# Altium schematic sheet SelfDrivingCar_SCH_Others.SchDoc
size A; DocumentNumber: 7; SheetNumber: 6; SheetTotal: 7
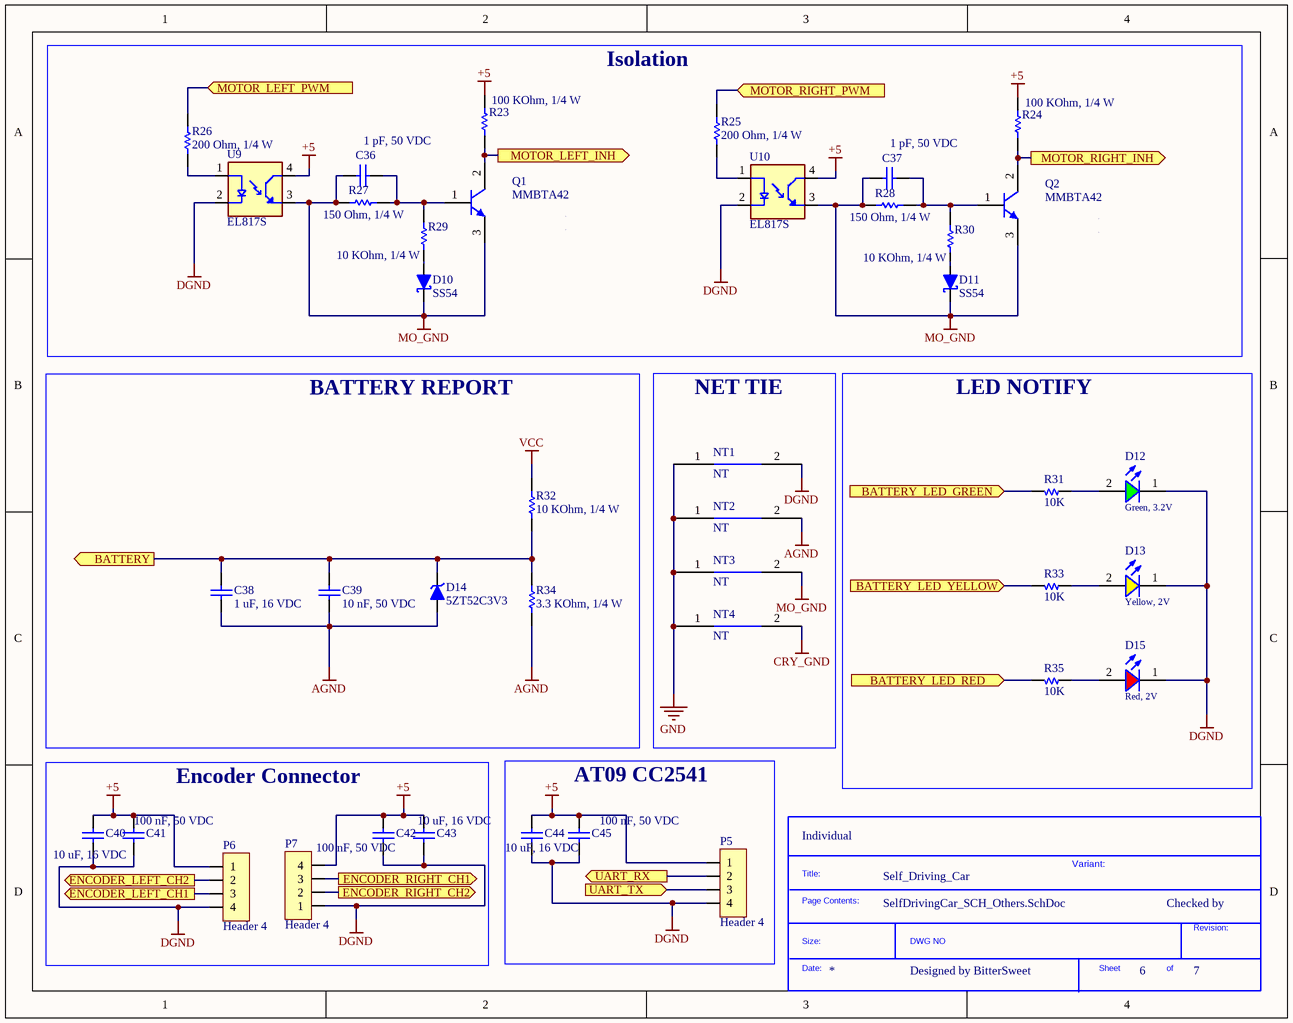
[diagram p0: SelfDrivingCar_SCH_Others.SchDoc]

## Parts
*?  SDTitleBlock  (value not drawn)  (graphical)
C36  1 pF, 50 VDC  [CAP_0603]
C37  1 pF, 50 VDC  [CAP_0603]
C38  1 uF, 16 VDC  [CAP_0603]
C39  10 nF, 50 VDC  [CAP_0603]
C40  10 uF, 16 VDC  [CAP_0603]
C41  100 nF, 50 VDC  [CAP_0603]
C42  100 nF, 50 VDC  [CAP_0603]
C43  10 uF, 16 VDC  [CAP_0603]
C44  10 uF, 16 VDC  [CAP_0603]
C45  100 nF, 50 VDC  [CAP_0603]
D10  SS54  [DO-214AC (SMA)]
D11  SS54  [DO-214AC (SMA)]
D12  Green, 3.2V  [WL-SMCW_0603_H=0.7mm]
D13  Yellow, 2V  [WL-SMCW_0603_H=0.7mm]
D14  5ZT52C3V3  [SOD123]
D15  Red, 2V  [WL-SMCW_0603_H=0.7mm]
NT1  NT  [NETTIE_2_0mm]  (net tie, no BOM)
NT2  NT  [NETTIE_0_5mm]  (net tie, no BOM)
NT3  NT  [NETTIE_2_0mm]  (net tie, no BOM)
NT4  NT  [NETTIE_0_5mm]  (net tie, no BOM)
P5  Header 4  [HDR/Header/4/BOX/SMD]
P6  Header 4  [HDR/Header/4/BOX/SMD]
P7  Header 4  [HDR/Header/4/BOX/SMD]
Q1  MMBTA42  [MMBT-SOT23]
Q2  MMBTA42  [MMBT-SOT23]
R23  100 KOhm, 1/4 W  [resistor_0603]
R24  100 KOhm, 1/4 W  [resistor_0603]
R25  200 Ohm, 1/4 W  [resistor_0603]
R26  200 Ohm, 1/4 W  [resistor_0603]
R27  150 Ohm, 1/4 W  [resistor_0603]
R28  150 Ohm, 1/4 W  [resistor_0603]
R29  10 KOhm, 1/4 W  [resistor_0603]
R30  10 KOhm, 1/4 W  [resistor_0603]
R31  10K  [R 0603]
R32  10 KOhm, 1/4 W  [resistor_0603]
R33  10K  [R 0603]
R34  3.3 KOhm, 1/4 W  [resistor_0603]
R35  10K  [R 0603]
U9  EL817S  [EL817S]
U10  EL817S  [EL817S]

## Blocks framed on the sheet
Isolation: C36 C37 D10 D11 Q1 Q2 R23-R30 U9 U10
BATTERY REPORT: C38 C39 D14 R32 R34
NET TIE: NT1-NT4
LED NOTIFY: D12 D13 D15 R31 R33 R35
Encoder Connector: C40-C43 P6 P7
AT09 CC2541: C44 C45 P5

## Ports
BATTERY (out), BATTERY_LED_GREEN (in), BATTERY_LED_RED (in), BATTERY_LED_YELLOW (in), ENCODER_LEFT_CH1 (out), ENCODER_LEFT_CH2 (out), ENCODER_RIGHT_CH1 (out), ENCODER_RIGHT_CH2 (out), MOTOR_LEFT_INH (out), MOTOR_LEFT_PWM (in), MOTOR_RIGHT_INH (out), MOTOR_RIGHT_PWM (in), UART_RX (out), UART_TX (in)

## Nets
+5: C40.2 C41.2 C42.2 C43.2 C44.2 C45.2 P5.1 P6.1 P7.4 R23.2 R24.2 U9.4(CT) U10.4(CT)
AGND: C38.2 C39.1 D14.1(A) NT2.2 R34.1
CRY_GND: NT4.2
DGND: C40.1 C41.1 C42.1 C43.1 C44.1 C45.1 D12.1(K) D13.1(K) D15.1(K) NT1.2 P5.4 P6.4 P7.1 U9.2(C) U10.2(C)
GND: NT1.1 NT2.1 NT3.1 NT4.1
MO_GND: C36.2 C37.2 D10.2(K) D11.2(K) NT3.2 Q1.3(E) Q2.3(E) R27.1 R28.1 U9.3(ET) U10.3(ET)
VCC: R32.2
BATTERY: C38.1 C39.2 D14.2(K) R32.1 R34.2 ; port BATTERY
BATTERY_LED_GREEN: R31.2 ; port BATTERY_LED_GREEN
BATTERY_LED_RED: R35.2 ; port BATTERY_LED_RED
BATTERY_LED_YELLOW: R33.2 ; port BATTERY_LED_YELLOW
ENCODER_LEFT_CH1: P6.3 ; port ENCODER_LEFT_CH1
ENCODER_LEFT_CH2: P6.2 ; port ENCODER_LEFT_CH2
ENCODER_RIGHT_CH1: P7.3 ; port ENCODER_RIGHT_CH1
ENCODER_RIGHT_CH2: P7.2 ; port ENCODER_RIGHT_CH2
MOTOR_LEFT_INH: Q1.2(C) R23.1 ; port MOTOR_LEFT_INH
MOTOR_LEFT_PWM: R26.2 ; port MOTOR_LEFT_PWM
MOTOR_RIGHT_INH: Q2.2(C) R24.1 ; port MOTOR_RIGHT_INH
MOTOR_RIGHT_PWM: R25.2 ; port MOTOR_RIGHT_PWM
UART_RX: P5.2 ; port UART_RX
UART_TX: P5.3 ; port UART_TX
NetC36_1: C36.1 Q1.1(B) R27.2 R29.2
NetC37_1: C37.1 Q2.1(B) R28.2 R30.2
NetD10_1: D10.1(A) R29.1
NetD11_1: D11.1(A) R30.1
NetD12_2: D12.2(A) R31.1
NetD13_2: D13.2(A) R33.1
NetD15_2: D15.2(A) R35.1
NetR25_1: R25.1 U10.1(A)
NetR26_1: R26.1 U9.1(A)

## Notes on the sheet
- (near *?) Individual
- Self_Driving_Car
- Variant:
- Checked by
- Designed by BitterSweet
- (in symbol SDTitleBlock) Title:; Page Contents:; Revision:; Size:; DWG NO; Date:; Sheet; of

## Library data of the parts
C36 C37 = 0106031051016: CAP, size 0603, 1 pF, 50 VDC; Manufacture Name: Samsung Electro-Mechanics; Manufacture SN: CL10B105KO8NNWC; Capacitance: 1 uF; Tolerance: +/-10%; Voltage Rating DC: 50 VDC; ComponentLink2Description: Datasheet; ComponentLink2URL: https://www.mouser.vn/datasheet/2/585/Samsung_MLCC_1837944-1929650.pdf; Operating Temperature: -55 to +125degC; Packaging: Tape and Reel; Mounting Technology: SMT; Size: 0603; Supplier 1 Name: Mouser; Supplier 1 SN: 187-CL10B105KO8NNWC; Supplier 1 URL: https://www.mouser.vn/ProductDetail/Samsung-Electro-Mechanics/CL10B105KO8NNWC?qs=81r%252BiQLm7BT%252BXtc72qn1ug%3D%3D&utm_source=mouser-refine-download&utm_medium=file&utm_campaign=CL10B105KO8NNWC&utm_content=Samsung-Electro-Mechanics; Supplier 2 Name: Digi-Key; Supplier 2 SN: 1276-CL10B105KO8NNWCTR-ND; Supplier 2 URL: https://www.digikey.com/en/products/detail/samsung-electro-mechanics/cl10b105ko8nnwc/16572783; Supplier 3 Name: thegioiic; Supplier 3 SN: N/A; Supplier 3 URL: https://www.thegioiic.com/tu-gom-0603-1uf-16v; Value: 1 pF, 50 VDC
C38 = 0106031051016: CAP, size 0603, 1 uF, 16 VDC; Manufacture Name: Samsung Electro-Mechanics; Manufacture SN: CL10B105KO8NNWC; Capacitance: 1 uF; Tolerance: +/-10%; Voltage Rating DC: 16 VDC; ComponentLink2Description: Datasheet; ComponentLink2URL: https://www.mouser.vn/datasheet/2/585/Samsung_MLCC_1837944-1929650.pdf; Operating Temperature: -55 to +125degC; Packaging: Tape and Reel; Mounting Technology: SMT; Size: 0603; Supplier 1 Name: Mouser; Supplier 1 SN: 187-CL10B105KO8NNWC; Supplier 1 URL: https://www.mouser.vn/ProductDetail/Samsung-Electro-Mechanics/CL10B105KO8NNWC?qs=81r%252BiQLm7BT%252BXtc72qn1ug%3D%3D&utm_source=mouser-refine-download&utm_medium=file&utm_campaign=CL10B105KO8NNWC&utm_content=Samsung-Electro-Mechanics; Supplier 2 Name: Digi-Key; Supplier 2 SN: 1276-CL10B105KO8NNWCTR-ND; Supplier 2 URL: https://www.digikey.com/en/products/detail/samsung-electro-mechanics/cl10b105ko8nnwc/16572783; Supplier 3 Name: thegioiic; Supplier 3 SN: N/A; Supplier 3 URL: https://www.thegioiic.com/tu-gom-0603-1uf-16v; Value: 1 uF, 16 VDC
C39 = 0106031030550: CAP, size 0603, 10 nF, 50 VDC; Manufacture Name: TDK; Manufacture SN: CGA3E2C0G1H103J080AE; Capacitance: 10 nF; Tolerance: +/-5%; Voltage Rating DC: 50 VDC; ComponentLink2Description: Datasheet; ComponentLink2URL: https://product.tdk.com/system/files/dam/doc/product/capacitor/ceramic/mlcc/catalog/mlcc_automotive_soft_en.pdf?ref_disty=mouser; Operating Temperature: -55 to +125degC; Packaging: Tape and Reel; Mounting Technology: SMT; Size: 0603; Supplier 1 Name: Mouser; Supplier 1 SN: 810-CGA3E2C0G1H103J8; Supplier 1 URL: https://www.mouser.com/ProductDetail/TDK/CGA3E2C0G1H103J080AE?qs=P1JMDcb91o6ZkMITrWTUZQ%3D%3D&utm_source=mouser-refine-download&utm_medium=file&utm_campaign=CGA3E2C0G1H103J080AE&utm_content=TDK; Supplier 2 Name: Digi-Key; Supplier 2 SN: 445-CGA3E2C0G1H103J080AETR-ND; Supplier 2 URL: https://www.digikey.com/en/products/detail/tdk-corporation/cga3e2c0g1h103j080ae/11697946; Supplier 3 Name: thegioiic; Supplier 3 SN: N/A; Supplier 3 URL: https://www.thegioiic.com/product/tu-gom-dan-smd?prid=6679,5762; Value: 10 nF, 50 VDC
C40 C43 C44 = 0106031061010: CAP, size 0603, 10 uF, 16 VDC; Manufacture Name: Samsung Electro-Mechanics; Manufacture SN: CL10A106KP8NNWC; Capacitance: 10 uF; Tolerance: +/-10%; Voltage Rating DC: 16 VDC; ComponentLink2Description: Datasheet; ComponentLink2URL: https://www.mouser.vn/datasheet/2/585/MLCC-1837944.pdf; Operating Temperature: -55 to +125degC; Packaging: Tape and Reel; Mounting Technology: SMT; Size: 0603; Supplier 1 Name: Mouser; Supplier 1 SN: 187-CL10A106KP8NNWC; Supplier 1 URL: https://www.mouser.vn/ProductDetail/Samsung-Electro-Mechanics/CL10A106KP8NNWC?qs=xZ%2FP%252Ba9zWqZx8LSX23YqWA%3D%3D&utm_source=mouser-refine-download&utm_medium=file&utm_campaign=CL10A106KP8NNWC&utm_content=Samsung-Electro-Mechanics; Supplier 2 Name: Digi-Key; Supplier 2 SN: 1276-CL10A106KP8NNWCTR-ND; Supplier 2 URL: https://www.digikey.com/en/products/detail/samsung-electro-mechanics/cl10a106kp8nnwc/16572907; Supplier 3 Name: thegioiic; Supplier 3 SN: N/A; Supplier 3 URL: https://www.thegioiic.com/tu-gom-0603-10uf-16v; Value: 10 uF, 16 VDC
C41 C42 C45 = 0106031041050: CAP, size 0603, 100 nF, 16 VDC; Manufacture Name: TDK; Manufacture SN: CGA3E3X8R1H104K080AE; Capacitance: 100 nF; Tolerance: +/-10%; Voltage Rating DC: 16 VDC; ComponentLink2Description: Datasheet; ComponentLink2URL: https://product.tdk.com/system/files/dam/doc/product/capacitor/ceramic/mlcc/catalog/mlcc_automotive_soft_en.pdf?ref_disty=mouser; Operating Temperature: -55 to +125degC; Packaging: Tape and Reel; Mounting Technology: SMT; Size: 0603; Supplier 1 Name: Mouser; Supplier 1 SN: 810-CGA3E3X8R1H104KA; Supplier 1 URL: https://www.mouser.com/ProductDetail/TDK/CGA3E3X8R1H104K080AE?qs=nQSIdc08i%252Bd8g3IRRgU2bw%3D%3D&utm_source=mouser-refine-download&utm_medium=file&utm_campaign=CGA3E3X8R1H104K080AE&utm_content=TDK; Supplier 2 Name: Digi-Key; Supplier 2 SN: 445-173697-2-ND; Supplier 2 URL: https://www.digikey.com/en/products/detail/tdk-corporation/cga3e3x8r1h104k080ae/5809262; Supplier 3 Name: thegioiic; Supplier 3 SN: N/A; Supplier 3 URL: https://www.thegioiic.com/tu-gom-0603-100nf-0-1uf-16v; Value: 100 nF, 50 VDC
D10 D11 = Diode Schottky: Schottky Diode; ComponentLink1Description: URL; ComponentLink1URL: https://www.thegioiic.com/ss54-sma-diode-shotky-5a-40v
D12 = 160603GreenClear: WL-SMCW SMT Mono-color Chip LED Waterclear, size 0603, Green, 3.2V, 140deg; Type: Clear; Color: Green; Size: 0603; ComponentLink1Description: Datasheet link; ComponentLink1URL: N/A; ComponentLink2Description: Supplier 1 URL; ComponentLink2URL: https://www.mouser.vn/ProductDetail/Wurth-Elektronik/150060GS75000?qs=LlUlMxKIyB0UYkq5lDO8nA%3D%3D; ComponentLink3Description: Supplier 2 URL; ComponentLink3URL: https://www.digikey.com/en/products/detail/liteon/LTST-C191KGKT/386835; ComponentLink4Description: Supplier 3 URL; ComponentLink4URL: https://www.thegioiic.com/led-xanh-la-0603-dan-smd-trong-suot; Supplier 1 Name: Mouser; Supplier 1 SN: 710-150060GS75000; Supplier 1 URL: https://www.mouser.vn/ProductDetail/Wurth-Elektronik/150060GS75000?qs=LlUlMxKIyB0UYkq5lDO8nA%3D%3D; Supplier 2 Name: Digi-Key; Supplier 2 SN: 160-1446-2-ND; Supplier 2 URL: https://www.digikey.com/en/products/detail/liteon/LTST-C191KGKT/386835; Supplier 3 Name: ICDayRoi; Supplier 3 SN: N/A; Supplier 3 URL: https://www.thegioiic.com/led-xanh-la-0603-dan-smd-trong-suot; Value: Green, 3.2V
D13 = 160603YellowClear: WL-SMCW SMT Mono-color Chip LED Waterclear, size 0603, Yellow, 2V, 140deg; Type: Clear; Color: Yellow; Size: 0603; ComponentLink1Description: Datasheet link; ComponentLink1URL: N/A; ComponentLink2Description: Supplier 1 URL; ComponentLink2URL: https://www.mouser.com/ProductDetail/Wurth-Elektronik/150060YS75003?qs=Li%252BoUPsLEnvfob7qsAi9dA%3D%3D; ComponentLink3Description: Supplier 2 URL; ComponentLink3URL: https://www.digikey.com/en/products/detail/liteon/LTST-C191KSKT/386839; ComponentLink4Description: Supplier 3 URL; ComponentLink4URL: https://icdayroi.com/led-yellow-0603; Supplier 1 Name: Mouser; Supplier 1 SN: 710-150060YS75003; Supplier 1 URL: https://www.mouser.com/ProductDetail/Wurth-Elektronik/150060YS75003?qs=Li%252BoUPsLEnvfob7qsAi9dA%3D%3D; Supplier 2 Name: Digi-Key; Supplier 2 SN: 160-1448-2-ND; Supplier 2 URL: https://www.digikey.com/en/products/detail/liteon/LTST-C191KSKT/386839; Supplier 3 Name: ICDayRoi; Supplier 3 SN: N/A; Supplier 3 URL: https://icdayroi.com/led-yellow-0603; Value: Yellow, 2V
D14 = Diode Zener: Zener Diode; ComponentLink1Description: URL; ComponentLink1URL: https://www.thegioiic.com/bzt52h-c3v3-diode-zener-3-3v-375mw-sod-123f
D15 = 160603RedClear: WL-SMCW SMT Mono-color Chip LED Waterclear, size 0603, Red, 2V, 140deg; Type: Clear; Color: Red; Size: 0603; ComponentLink1Description: Datasheet link; ComponentLink1URL: N/A; ComponentLink2Description: Supplier 1 URL; ComponentLink2URL: https://www.mouser.vn/ProductDetail/Wurth-Elektronik/150060RS75000?qs=LlUlMxKIyB3QnmZ3fw%2FVCA%3D%3D; ComponentLink3Description: Supplier 2 URL; ComponentLink3URL: https://www.digikey.com/en/products/detail/liteon/LTST-C191KRKT/386837; ComponentLink4Description: Supplier 3 URL; ComponentLink4URL: https://www.thegioiic.com/led-do-0603-dan-smd-trong-suot; Supplier 1 Name: Mouser; Supplier 1 SN: 710-150060RS75000; Supplier 1 URL: https://www.mouser.vn/ProductDetail/Wurth-Elektronik/150060RS75000?qs=LlUlMxKIyB3QnmZ3fw%2FVCA%3D%3D; Supplier 2 Name: Digi-Key; Supplier 2 SN: 160-1447-2-ND; Supplier 2 URL: https://www.digikey.com/en/products/detail/liteon/LTST-C191KRKT/386837; Supplier 3 Name: ICDayRoi; Supplier 3 SN: N/A; Supplier 3 URL: https://www.thegioiic.com/led-do-0603-dan-smd-trong-suot; Value: Red, 2V
NT1-NT4 = NetTie_SMD
P5-P7 = Header 4: Header, 4-Pin; ComponentLink1Description: URL; ComponentLink1URL: https://www.thegioiic.com/dau-xh-2-54mm-4-chan-dan-smd-nam-ngang
Q1 Q2 = MMBTA42: TRANS NPN, 40V, 0.2A, SOT23-3; Voltage - Collector Emitter Breakdown: 300V; Current - Collector: 500mA; DC Current Gain: 80-200; Power Dissipation: 250mW; Gain Bandwidth Product fT: 50MHz; Transistor Type: NPN; Package: SOT-23; Supplier 1 Name: Mouser; Supplier 1 SN: 637-MMBTA42; Supplier 1 URL: https://www.mouser.vn/ProductDetail/Diotec-Semiconductor/MMBTA42?qs=OlC7AqGiEDkTSphcOD18pw%3D%3D; Supplier 2 Name: Digi-Key; Supplier 2 SN: 2796-MMBTA42TR-ND; Supplier 2 URL: https://www.digikey.com/en/products/detail/diotec-semiconductor/MMBTA42/13163233; Supplier 3 Name: thegioiic; Supplier 3 SN: N/A; Supplier 3 URL: https://www.thegioiic.com/mmbt3904-1am-transistor-npn-40v-0-2a-3-chan-sot-23; Value: MMBTA42
R23 R24 = 0006031041: RES, size 0603, 100 KOhm, 1/4 W; Manufacture  Name: OEM; Rated Power: 1/4 W; Resistance Tolerance: +/-1%; Resistance: 100 KOhm; Size: 0603; Mounting Technology: SMT; Supplier 1 Name: Mouser; Supplier 1 SN: 603-SR0603FR-7T100KL; Supplier 2 Name: Digi-Key; Supplier 2 SN: YAG5821TR-ND YAG5821CT-ND YAG5821DKR-ND; Supplier 1 URL: https://www.mouser.vn/ProductDetail/YAGEO/SR0603FR-7T100KL?qs=sGAEpiMZZMvdGkrng054tz1y1XEHv7sNa%252BA%2F4WiDMf7aGw4zRBb%2FFQ%3D%3D; Supplier 3 Name: thegioiic; Supplier 3 SN: N/A; Supplier 3 URL: https://www.thegioiic.com/dien-tro-100-kohm-0603-1-; Manufacture  SN: OEM; Value: 100 KOhm, 1/4 W; ComponentLink1Description: Datasheet link; ComponentLink1URL: https://www.yageo.com/upload/media/product/productsearch/datasheet/rchip/PYu-SR_20105_RoHS_L_10.pdf; ComponentLink2Description: Supplier 1 URL; ComponentLink2URL: N/A; ComponentLink3Description: Supplier 2 URL; ComponentLink3URL: https://www.digikey.com/en/products/detail/yageo/SR0603FR-7T100KL/9373095; ComponentLink4Description: Supplier 3 URL; ComponentLink4URL: N/A; Supplier 2 URL: https://www.digikey.com/en/products/detail/yageo/SR0603FR-7T100KL/9373095
R25 R26 = 0006032211: RES, size 0603, 220 Ohm, 1/4 W; Manufacture  Name: OEM; Resistance: 200 Ohm; Rated Power: 1/4 W; Resistance Tolerance: +/-1%; Size: 0603; Mounting Technology: SMT; Supplier 1 Name: Mouser; Supplier 1 SN: 667-ERJ-UP3F2200V; Supplier 2 Name: Digi-Key; Supplier 2 SN: 10-ERJ-UP3F2200VTR-ND 10-ERJ-UP3F2200VCT-ND 10-ERJ-UP3F2200VDKR-ND; Supplier 1 URL: https://www.mouser.vn/ProductDetail/Panasonic/ERJ-UP3F2200V?qs=sGAEpiMZZMvdGkrng054twq3eZrCFN89E%252BhCXuCu3h8RslmTO1I28Q%3D%3D; Supplier 3 Name: thegioiic; Supplier 3 SN: N/A; Supplier 3 URL: https://www.thegioiic.com/dien-tro-200-ohm-0603-5-; Manufacture  SN: OEM; Value: 200 Ohm, 1/4 W; ComponentLink1Description: Datasheet link; ComponentLink1URL: https://api.pim.na.industrial.panasonic.com/file_stream/main/fileversion/4484; ComponentLink2Description: Supplier 1 URL; ComponentLink2URL: N/A; ComponentLink3Description: Supplier 2 URL; ComponentLink3URL: https://www.digikey.com/en/products/detail/panasonic-electronic-components/ERJ-UP3F2200V/12092129; ComponentLink4Description: Supplier 3 URL; ComponentLink4URL: N/A; Supplier 2 URL: https://www.digikey.com/en/products/detail/panasonic-electronic-components/ERJ-UP3F2200V/12092129
R27 R28 = 0006031511: RES, size 0603, 150 Ohm, 1/4 W; Manufacture  Name: OEM; Resistance: 150 Ohm; Rated Power: 1/4 W; Resistance Tolerance: +/-1%; Size: 0603; Mounting Technology: SMT; Supplier 1 Name: Mouser; Supplier 1 SN: 667-ERJ-UP3F1500V; Supplier 2 Name: Digi-Key; Supplier 2 SN: 10-ERJ-UP3F1500VTR-ND 10-ERJ-UP3F1500VCT-ND 10-ERJ-UP3F1500VDKR-ND; Supplier 1 URL: https://www.mouser.vn/ProductDetail/Panasonic/ERJ-UP3F1500V?qs=sGAEpiMZZMvdGkrng054twq3eZrCFN89aN9HHZ6KB345kfMKb%252BB8mQ%3D%3D; Supplier 3 Name: thegioiic; Supplier 3 SN: N/A; Supplier 3 URL: https://thegioiic.com/dien-tro-150-ohm-0603-1-; Manufacture  SN: OEM; Value: 150 Ohm, 1/4 W; ComponentLink1Description: Datasheet link; ComponentLink1URL: https://api.pim.na.industrial.panasonic.com/file_stream/main/fileversion/4484; ComponentLink2Description: Supplier 1 URL; ComponentLink2URL: N/A; ComponentLink3Description: Supplier 2 URL; ComponentLink3URL: N/A; ComponentLink4Description: Supplier 3 URL; ComponentLink4URL: N/A; Supplier 2 URL: N/A
R29 R30 R32 = 0006031031: RES, size 0603, 10 KOhm, 1/4 W; Manufacture  Name: OEM; Resistance: 10 KOhm; Rated Power: 1/4 W; Resistance Tolerance: +/-1%; Size: 0603; Mounting Technology: SMT; Supplier 1 Name: Mouser; Supplier 1 SN: 755-ESR03EZPF1002; Supplier 2 Name: Digi-Key; Supplier 2 SN: RHM10KADTR-ND RHM10KADCT-ND RHM10KADDKR-ND; Supplier 1 URL: https://www.mouser.vn/ProductDetail/ROHM-Semiconductor/ESR03EZPF1002?qs=sGAEpiMZZMvdGkrng054t67Efho1F8r6CDeAsqwFse8%3D; Supplier 3 Name: thegioiic; Supplier 3 SN: N/A; Supplier 3 URL: https://www.thegioiic.com/dien-tro-10-kohm-0603-1-; Manufacture  SN: OEM; Value: 10 KOhm, 1/4 W; ComponentLink1Description: Datasheet link; ComponentLink1URL: https://fscdn.rohm.com/en/products/databook/datasheet/passive/resistor/chip_resistor/esr-e.pdf; ComponentLink2Description: Supplier 1 URL; ComponentLink2URL: N/A; ComponentLink3Description: Supplier 2 URL; ComponentLink3URL: https://www.digikey.com/en/products/detail/rohm-semiconductor/ESR03EZPF1002/1983429; ComponentLink4Description: Supplier 3 URL; ComponentLink4URL: N/A; Supplier 2 URL: https://www.digikey.com/en/products/detail/rohm-semiconductor/ESR03EZPF1002/1983429
R31 R33 R35 = Resistor: ComponentLink1Description: URL; ComponentLink1URL: https://www.thegioiic.com/dien-tro-10-kohm-0603-1-
R34 = 0006033321: RES, size 0603, 3.3 KOhm, 1/4 W; Manufacture  Name: OEM; Rated Power: 1/4 W; Resistance Tolerance: +/-1%; Resistance: 3.3 KOhm; Size: 0603; Mounting Technology: SMT; Supplier 1 Name: Mouser; Supplier 1 SN: 667-ERJ-PA3F3301V; Supplier 2 Name: Digi-Key; Supplier 2 SN: 10-ERJ-UP3F3301VTR-ND 10-ERJ-UP3F3301VCT-ND 10-ERJ-UP3F3301VDKR-ND; Supplier 1 URL: https://www.mouser.vn/ProductDetail/Panasonic/ERJ-PA3F3301V?qs=sGAEpiMZZMvdGkrng054t6%2FAfIpq60YDpB2wwO%252BBqIBQy72ynM%2FI9Q%3D%3D; Supplier 3 Name: thegioiic; Supplier 3 SN: N/A; Supplier 3 URL: https://www.thegioiic.com/product/dien-tro-dan-smd?prid=6628,22791; Manufacture  SN: OEM; Value: 3.3 KOhm, 1/4 W; ComponentLink1Description: Datasheet link; ComponentLink1URL: https://api.pim.na.industrial.panasonic.com/file_stream/main/fileversion/4484; ComponentLink2Description: Supplier 1 URL; ComponentLink2URL: N/A; ComponentLink3Description: Supplier 2 URL; ComponentLink3URL: https://www.digikey.com/en/products/detail/panasonic-electronic-components/ERJ-UP3F3301V/12093093; ComponentLink4Description: Supplier 3 URL; ComponentLink4URL: N/A; Supplier 2 URL: https://www.digikey.com/en/products/detail/panasonic-electronic-components/ERJ-UP3F3301V/12093093
U9 U10 = EL817S: Optocouplers 5000Vrms 1 Channel, 4-SMD; ComponentLink1Description: URL; ComponentLink1URL: https://www.thegioiic.com/el817s-transistor-output-optocouplers-5000vrms-1-channel-4-smd